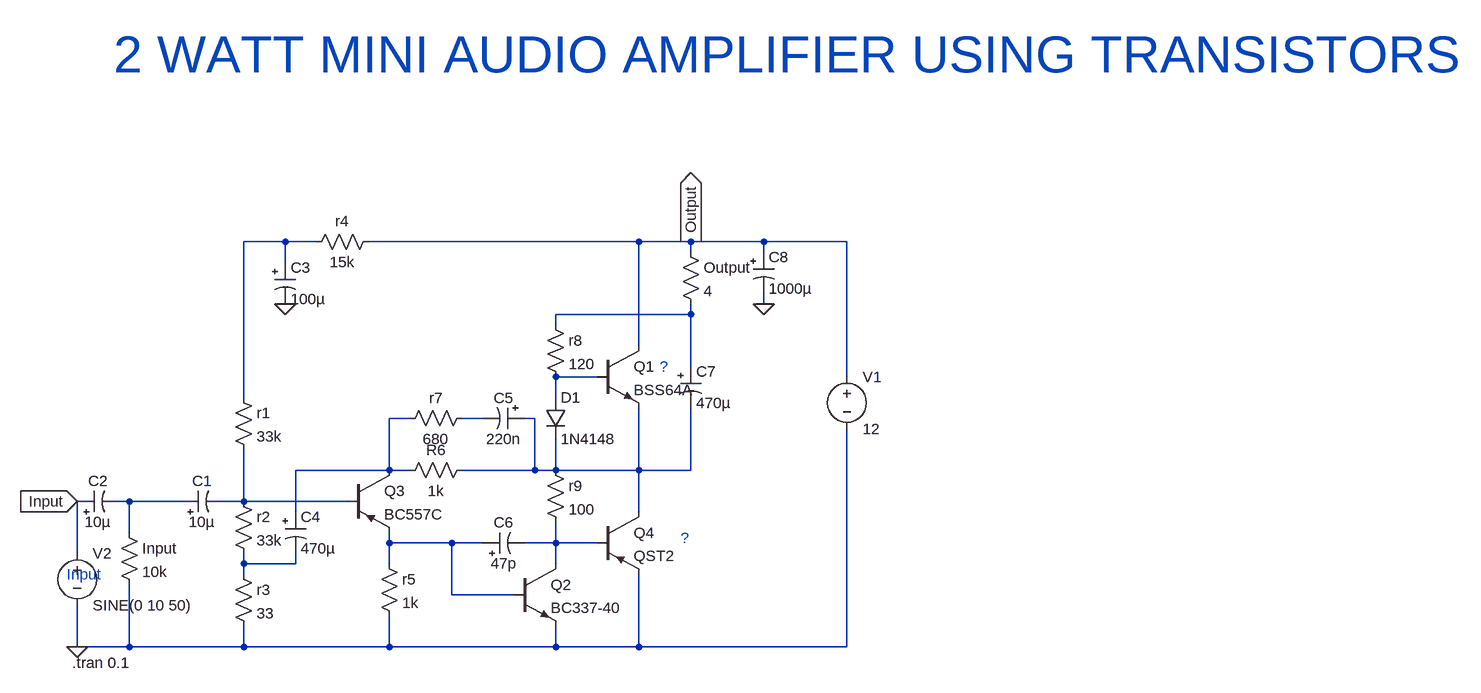
[diagram p0: schematic mini_audio_amplifier.asc]
mini_audio_amplifier.asc, the LTspice schematic file:
Version 4
SHEET 1 1568 680
WIRE 288 -240 224 -240
WIRE 336 -240 288 -240
WIRE 832 -240 416 -240
WIRE 912 -240 832 -240
WIRE 1024 -240 912 -240
WIRE 1152 -240 1024 -240
WIRE 912 -224 912 -240
WIRE 1024 -224 1024 -240
WIRE 288 -208 288 -240
WIRE 1024 -144 1024 -160
WIRE 912 -128 912 -144
WIRE 912 -128 704 -128
WIRE 704 -112 704 -128
WIRE 832 -80 832 -240
WIRE 912 -48 912 -128
WIRE 768 -32 704 -32
WIRE 1152 -32 1152 -240
WIRE 224 0 224 -240
WIRE 704 0 704 -32
WIRE 480 32 448 32
WIRE 592 32 560 32
WIRE 672 32 656 32
WIRE 448 112 448 32
WIRE 448 112 304 112
WIRE 480 112 448 112
WIRE 672 112 672 32
WIRE 672 112 560 112
WIRE 704 112 704 64
WIRE 704 112 672 112
WIRE 832 112 832 16
WIRE 832 112 704 112
WIRE 912 112 912 16
WIRE 912 112 832 112
WIRE 48 160 32 160
WIRE 128 160 48 160
WIRE 224 160 224 80
WIRE 224 160 192 160
WIRE 384 160 224 160
WIRE 304 176 304 112
WIRE 832 176 832 112
WIRE 48 208 48 160
WIRE 448 224 448 208
WIRE 544 224 448 224
WIRE 592 224 544 224
WIRE 704 224 704 192
WIRE 704 224 656 224
WIRE 768 224 704 224
WIRE -32 240 -32 160
WIRE 224 256 224 240
WIRE 304 256 304 240
WIRE 304 256 224 256
WIRE 448 256 448 224
WIRE 704 256 704 224
WIRE 224 272 224 256
WIRE 544 304 544 224
WIRE 640 304 544 304
WIRE -32 384 -32 320
WIRE 48 384 48 288
WIRE 48 384 -32 384
WIRE 224 384 224 352
WIRE 224 384 48 384
WIRE 448 384 448 336
WIRE 448 384 224 384
WIRE 704 384 704 352
WIRE 704 384 448 384
WIRE 832 384 832 272
WIRE 832 384 704 384
WIRE 1152 384 1152 48
WIRE 1152 384 832 384
FLAG 288 -144 0
FLAG 1024 -144 0
FLAG -32 160 Input
IOPIN -32 160 In
FLAG -32 384 0
FLAG 912 -240 Output
IOPIN 912 -240 Out
SYMBOL res 32 192 R0
SYMATTR InstName Input
SYMATTR Value 10k
SYMBOL res 208 256 R0
SYMATTR InstName r3
SYMATTR Value 33
SYMATTR SpiceLine pwr=0.25
SYMBOL res 208 144 R0
SYMATTR InstName r2
SYMATTR Value 33k
SYMATTR SpiceLine pwr=0.25
SYMBOL polcap -32 176 R270
WINDOW 0 32 32 VTop 2
WINDOW 3 0 32 VBottom 2
SYMATTR InstName C2
SYMATTR Value 10µ
SYMATTR Description Capacitor
SYMATTR Type cap
SYMATTR SpiceLine V=63 Irms=40m Rser=1.4137 Lser=2.07n mfg="Würth Elektronik" pn="865080743010 WCAP-ASLI 6,3x5,5" type="Al electrolytic"
SYMBOL res 208 -16 R0
SYMATTR InstName r1
SYMATTR Value 33k
SYMATTR SpiceLine pwr=0.25
SYMBOL res 432 -256 R90
WINDOW 0 0 56 VBottom 2
WINDOW 3 32 56 VTop 2
SYMATTR InstName r4
SYMATTR Value 15k
SYMATTR SpiceLine pwr=0.25
SYMBOL polcap 272 -208 R0
WINDOW 3 24 56 Left 2
SYMATTR Value 100µ
SYMATTR InstName C3
SYMATTR Description Capacitor
SYMATTR Type cap
SYMATTR SpiceLine V=25 Irms=102m Rser=0.5 Lser=2.9n mfg="Würth Elektronik" pn="865090445008 WCAP-ASLU 6,3x7,7" type="Al electrolytic"
SYMBOL polcap 288 176 R0
WINDOW 3 24 56 Left 2
SYMATTR Value 470µ
SYMATTR InstName C4
SYMATTR Description Capacitor
SYMATTR Type cap
SYMATTR SpiceLine V=25 Irms=410m Rser=0.076 Lser=6.34n mfg="Würth Elektronik" pn="860020474014 WCAP-ATG5 8x11,5" type="Al electrolytic"
SYMBOL res 576 96 R90
WINDOW 0 0 56 VBottom 2
WINDOW 3 32 56 VTop 2
SYMATTR InstName R6
SYMATTR Value 1k
SYMATTR SpiceLine pwr=0.25
SYMBOL res 576 16 R90
WINDOW 0 0 56 VBottom 2
WINDOW 3 32 56 VTop 2
SYMATTR InstName r7
SYMATTR Value 680
SYMATTR SpiceLine pwr=0.25
SYMBOL res 688 96 R0
SYMATTR InstName r9
SYMATTR Value 100
SYMATTR SpiceLine pwr=0.5
SYMBOL polcap 592 240 R270
WINDOW 0 32 32 VTop 2
WINDOW 3 0 32 VBottom 2
SYMATTR InstName C6
SYMATTR Value 47p
SYMATTR Description Capacitor
SYMATTR Type cap
SYMATTR SpiceLine V=63 Irms=32m Rser=1.4679 Lser=3.34n
SYMBOL res 688 -128 R0
SYMATTR InstName r8
SYMATTR Value 120
SYMATTR SpiceLine pwr=0.5
SYMBOL diode 688 0 R0
SYMATTR InstName D1
SYMATTR Value 1N4148
SYMBOL npn 768 -80 R0
SYMATTR InstName Q1
SYMATTR Value BSS64A
SYMBOL npn 640 256 R0
SYMATTR InstName Q2
SYMATTR Value BC337-40
SYMBOL pnp 384 112 R0
SYMATTR InstName Q3
SYMATTR Value BC557C
SYMBOL pnp 768 176 R0
SYMATTR InstName Q4
SYMATTR Value QST2
SYMBOL polcap 128 176 R270
WINDOW 0 32 32 VTop 2
WINDOW 3 0 32 VBottom 2
SYMATTR InstName C1
SYMATTR Value 10µ
SYMATTR Description Capacitor
SYMATTR Type cap
SYMATTR SpiceLine V=63 Irms=40m Rser=1.4137 Lser=2.07n mfg="Würth Elektronik" pn="865080743010 WCAP-ASLI 6,3x5,5" type="Al electrolytic"
SYMBOL polcap 896 -48 R0
WINDOW 3 24 56 Left 2
SYMATTR Value 470µ
SYMATTR InstName C7
SYMATTR Description Capacitor
SYMATTR Type cap
SYMATTR SpiceLine V=25 Irms=410m Rser=0.076 Lser=6.34n mfg="Würth Elektronik" pn="860020474014 WCAP-ATG5 8x11,5" type="Al electrolytic"
SYMBOL polcap 1008 -224 R0
WINDOW 3 24 56 Left 2
SYMATTR Value 1000µ
SYMATTR InstName C8
SYMATTR Description Capacitor
SYMATTR Type cap
SYMATTR SpiceLine V=25 Irms=1.82 Rser=0.0205 Lser=6.34n mfg="Würth Elektronik" pn="860040475011 WCAP-ATUL 10x30" type="Al electrolytic"
SYMBOL polcap 656 16 R90
WINDOW 0 0 32 VBottom 2
WINDOW 3 32 32 VTop 2
SYMATTR InstName C5
SYMATTR Value 220n
SYMATTR Description Capacitor
SYMATTR Type cap
SYMATTR SpiceLine V=63 Irms=32m Rser=1.4679 Lser=3.34n
SYMBOL res 432 240 R0
SYMATTR InstName r5
SYMATTR Value 1k
SYMATTR SpiceLine pwr=0.25
SYMBOL voltage 1152 -48 R0
WINDOW 123 0 0 Left 0
WINDOW 39 0 0 Left 0
SYMATTR InstName V1
SYMATTR Value 12
SYMBOL res 896 -240 R0
SYMATTR InstName Output
SYMATTR Value 4
SYMATTR SpiceLine pwr=4
SYMBOL voltage -32 224 R0
WINDOW 123 0 0 Left 0
WINDOW 39 0 0 Left 0
SYMATTR InstName V2
SYMATTR Value SINE(0 10 50)
TEXT -40 408 Left 2 !.tran 0.1
TEXT -48 272 Left 2 ;Input
TEXT 24 -528 Left 6 ;2 WATT MINI AUDIO AMPLIFIER USING TRANSISTORS
TEXT 864 -48 Left 2 ;?
TEXT 896 216 Left 2 ;?

The netlist it stands for:
* mini_audio_amplifier.asc
R§Input N007 0 10k
r3 N011 0 33 pwr=0.25
r2 N008 N011 33k pwr=0.25
C2 Input N007 10µ V=63 Irms=40m Rser=1.4137 Lser=2.07n mfg="Würth Elektronik" pn="865080743010 WCAP-ASLI 6,3x5,5" type="Al electrolytic"
r1 N001 N008 33k pwr=0.25
r4 Output N001 15k pwr=0.25
C3 N001 0 100µ V=25 Irms=102m Rser=0.5 Lser=2.9n mfg="Würth Elektronik" pn="865090445008 WCAP-ASLU 6,3x7,7" type="Al electrolytic"
C4 N004 N011 470µ V=25 Irms=410m Rser=0.076 Lser=6.34n mfg="Würth Elektronik" pn="860020474014 WCAP-ATG5 8x11,5" type="Al electrolytic"
R6 N006 N004 1k pwr=0.25
r7 N005 N004 680 pwr=0.25
r9 N006 N010 100 pwr=0.5
C6 N009 N010 47p V=63 Irms=32m Rser=1.4679 Lser=3.34n
r8 N002 N003 120 pwr=0.5
D1 N003 N006 1N4148
Q1 Output N003 N006 0 BSS64A
Q2 N010 N009 0 0 BC337-40
Q3 N004 N008 N009 0 BC557C
Q4 N006 N010 0 0 QST2
C1 N007 N008 10µ V=63 Irms=40m Rser=1.4137 Lser=2.07n mfg="Würth Elektronik" pn="865080743010 WCAP-ASLI 6,3x5,5" type="Al electrolytic"
C7 N002 N006 470µ V=25 Irms=410m Rser=0.076 Lser=6.34n mfg="Würth Elektronik" pn="860020474014 WCAP-ATG5 8x11,5" type="Al electrolytic"
C8 Output 0 1000µ V=25 Irms=1.82 Rser=0.0205 Lser=6.34n mfg="Würth Elektronik" pn="860040475011 WCAP-ATUL 10x30" type="Al electrolytic"
C5 N006 N005 220n V=63 Irms=32m Rser=1.4679 Lser=3.34n
r5 N009 0 1k pwr=0.25
V1 Output 0 12
R§Output Output N002 4 pwr=4
V2 Input 0 SINE(0 10 50)
.model D D
.lib standard.dio
.model NPN NPN
.model PNP PNP
.lib standard.bjt
.tran 0.1
* Input
* 2 WATT MINI AUDIO AMPLIFIER USING TRANSISTORS
* ?
* ?
.backanno
.end